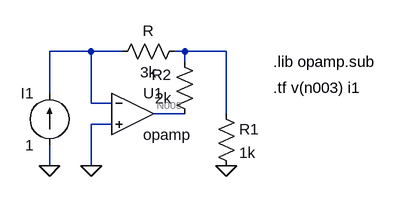
[diagram p0: schematic pag8es12.asc]
pag8es12.asc, the LTspice schematic file:
Version 4
SHEET 1 880 680
WIRE 80 16 16 16
WIRE 128 16 80 16
WIRE 224 16 208 16
WIRE 288 16 224 16
WIRE 224 32 224 16
WIRE 16 80 16 16
WIRE 80 96 80 16
WIRE 112 96 80 96
WIRE 224 112 176 112
WIRE 288 112 288 16
WIRE 112 128 80 128
WIRE 16 192 16 160
WIRE 80 192 80 128
FLAG 16 192 0
FLAG 80 192 0
FLAG 288 192 0
SYMBOL current 16 160 R180
WINDOW 0 24 80 Left 2
WINDOW 3 24 0 Left 2
SYMATTR InstName I1
SYMATTR Value 1
SYMBOL OpAmps\\opamp 144 48 R0
SYMATTR InstName U1
SYMBOL res 112 32 R270
WINDOW 0 32 56 VTop 2
WINDOW 3 0 56 VBottom 2
SYMATTR InstName R
SYMATTR Value 3k
SYMBOL res 272 96 R0
SYMATTR InstName R1
SYMATTR Value 1k
SYMBOL res 240 128 R180
WINDOW 0 36 76 Left 2
WINDOW 3 36 40 Left 2
SYMATTR InstName R2
SYMATTR Value 2k
TEXT 360 32 Left 2 !.lib opamp.sub
TEXT 360 72 Left 2 !.tf v(n003) i1

The netlist it stands for:
* pag8es12.asc
I1 0 N001 1
XU1 N001 0 N003 opamp Aol=100K GBW=10Meg  ; pins invin noninvin out
R N001 N002 3k
R1 N002 0 1k
R2 N003 N002 2k
.lib opamp.sub
.tf v(n003) i1
.backanno
.end